# EAGLE design BlinkyCircuit (EAGLE 9.5.1)
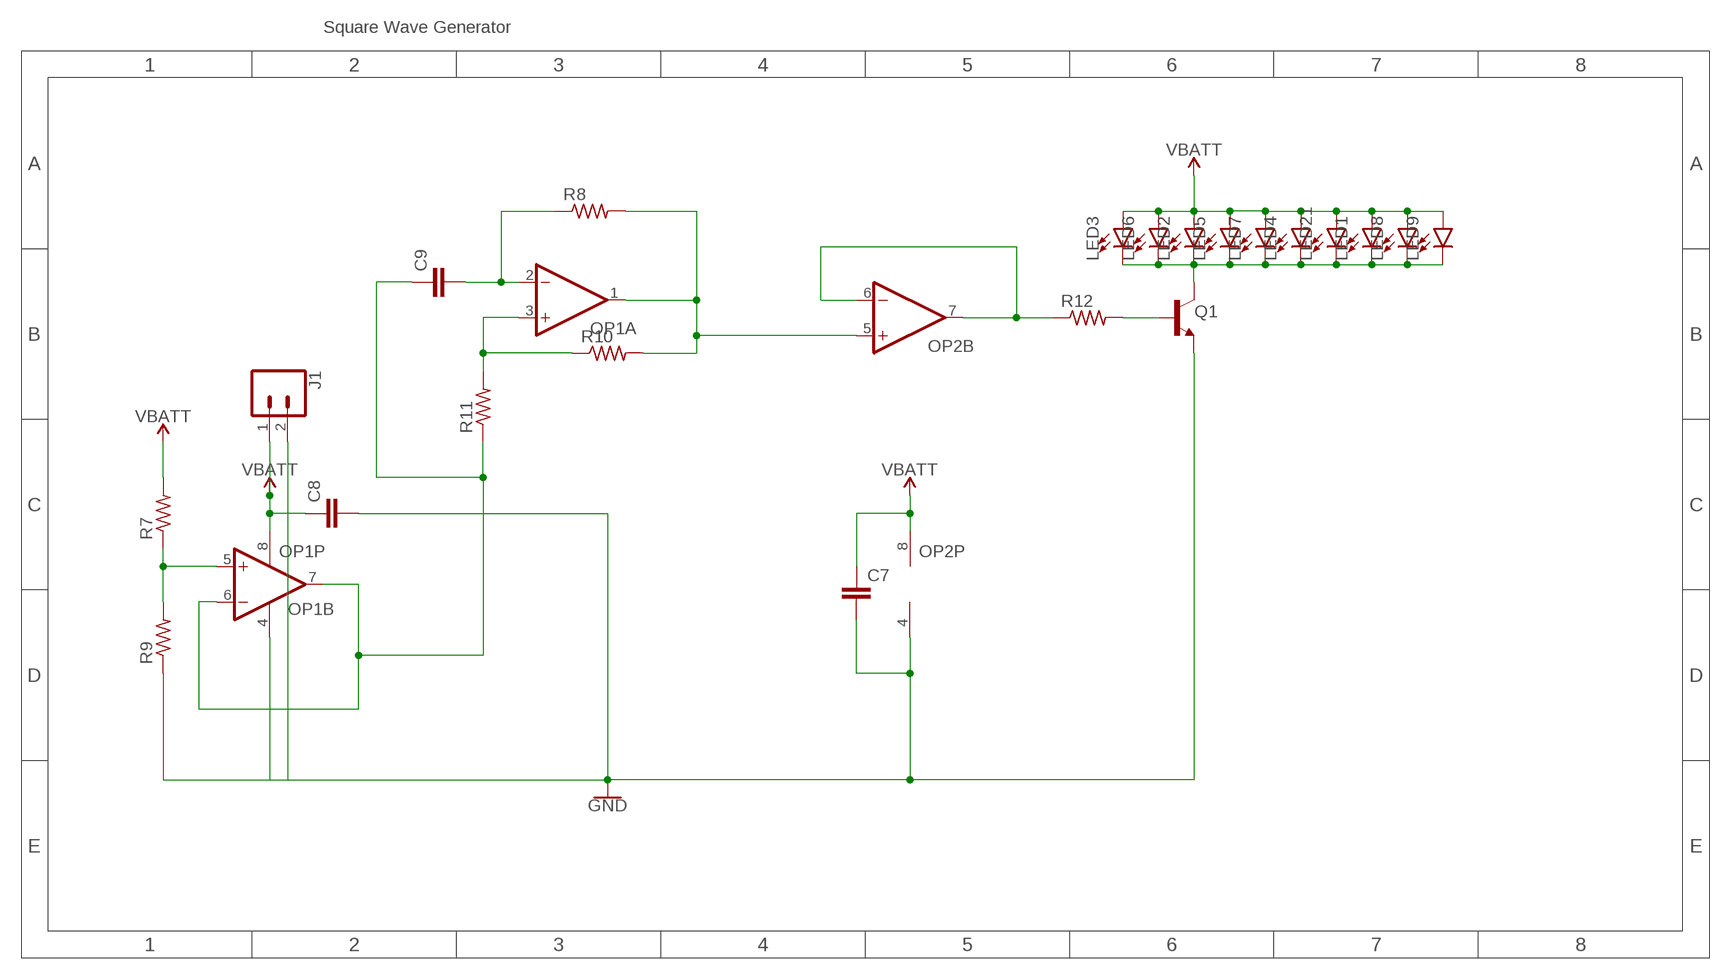
[diagram p0: schematic, sheet 1]

## Parts
C7  CAPACITOR0603  [C0603]
C8  CAPACITOR0603  [C0603]
C9  CAPACITOR0603  [C0603]
J1  CONN_02  [1X02]
LED1  LED5MM  [LED_5MM]
LED2  LED5MM  [LED_5MM]
LED3  LED5MM  [LED_5MM]
LED4  LED5MM  [LED_5MM]
LED5  LED5MM  [LED_5MM]
LED6  LED5MM  [LED_5MM]
LED7  LED5MM  [LED_5MM]
LED8  LED5MM  [LED_5MM]
LED9  LED5MM  [LED_5MM]
LED21  LED5MM  [LED_5MM]
OP1  OP-DUALR  [SO8]
OP2  OP-DUALR  [SO8]
Q1  NPN-GENERIC  [SOT23-3]
R7  RESISTOR0603  [R0603]
R8  RESISTOR0603  [R0603]
R9  RESISTOR0603  [R0603]
R10  RESISTOR0603  [R0603]
R11  RESISTOR0603  [R0603]
R12  RESISTOR0603  [R0603]

## Nets
GND: C7.2 C8.2 J1.2 OP1.4(P:V-) OP2.4(P:V-) Q1.2(E) R9.1
N$1: OP1.5(B:+IN) R7.1 R9.2
N$2: C9.2 OP1.2(A:-IN) R8.1
N$3: C9.1 OP1.6(B:-IN) OP1.7(B:OUT) R11.1
N$4: OP1.3(A:+IN) R10.1 R11.2
N$5: OP1.1(A:OUT) OP2.5(B:+IN) R8.2 R10.2
N$6: OP2.6(B:-IN) OP2.7(B:OUT) R12.1
N$7: Q1.1(B) R12.2
N$11: LED1.K(C) LED2.K(C) LED3.K(C) LED4.K(C) LED5.K(C) LED6.K(C) LED7.K(C) LED8.K(C) LED9.K(C) LED21.K(C) Q1.3(C)
V_BATT: C7.1 C8.1 J1.1 LED1.A LED2.A LED3.A LED4.A LED5.A LED6.A LED7.A LED8.A LED9.A LED21.A OP1.8(P:V+) OP2.8(P:V+) R7.2 ; supply symbol labelled VBATT
Unconnected: OP2.1(A:OUT) OP2.2(A:-IN) OP2.3(A:+IN)

## Notes on the sheet
- Square Wave Generator

## Library data of the parts
C7-C9 = LinnesLab-Passives:CAPACITOR
J1 = LinnesLab-Connectors:CONN_02: Multi connection point. Often used as Generic Header-pin footprint for 0.1 inch spaced/style header connections On any of the 0.1 inch spaced packages, you can populate with these: Break Away Headers - Straight <https://www.sparkfun.com/products/116> (PRT-00116) Break Away Male Headers - Right Angle <https://www.sparkfun.com/products/553> (PRT-00553) Female Headers <https://www.sparkfun.com/products/115> (PRT-00115) Break Away Headers - Machine Pin <https://www.sparkfun.com/products/117> (PRT-00117) Break Away Female Headers - Swiss Machine Pin <https://www.sparkfun.com/products/743> (PRT-00743) For SCREWTERMINALS and SPRING TERMINALS visit here: Screw Terimnals on SparkFun.com <https://www.sparkfun.com/search/results?term=Screw+Terminals> (5mm/3.5mm/2.54mm spacing) This device is also useful as a general connection point to wire up your design to another part of your project. Our various solder wires solder well into these plated through hole pads. Hook-Up Wire - Assortment (Stranded, 22 AWG) <https://www.sparkfun.com/products/11375> (PRT-11375) Hook-Up Wire - Assortment (Solid Core, 22 AWG) <https://www.sparkfun.com/products/11367> (PRT-11367) View the entire wire category on our website here <https://www.sparkfun.com/categories/141> Special notes: Molex polarized connector foot print use with: PRT-08233 with associated crimp pins and housings. 2.54_SCREWTERM for use with PRT-10571. 3.5mm Screw Terminal footprints for PRT-08084 5mm Screw Terminal footprints for use with PRT-08432
LED1-LED9 LED21 = LinnesLab-LED:LED: LED (Generic) Standard schematic elements and footprints for 5mm, 3mm, 1206, and 0603 sized LEDs. Generic LEDs with no color specified. LTST-C190KGKT: arrow indicates cathode
OP1 OP2 = LinnesLab-AnalogIC:OP-DUAL: Precision Micropower, Low Noise CMOS, Rail-to-Rail Input/Output Operational Amplifiers Source: http://www.analog.com/static/imported-files/data_sheets/AD8603_8607_8609.pdf; MPN: AD8607ARMZ-R2; OC_FARNELL: 1651293; OC_NEWARK: 19M8927
Q1 = LinnesLab-DiscreteSemi:NPN
R7-R12 = LinnesLab-Passives:RESISTOR

## Board
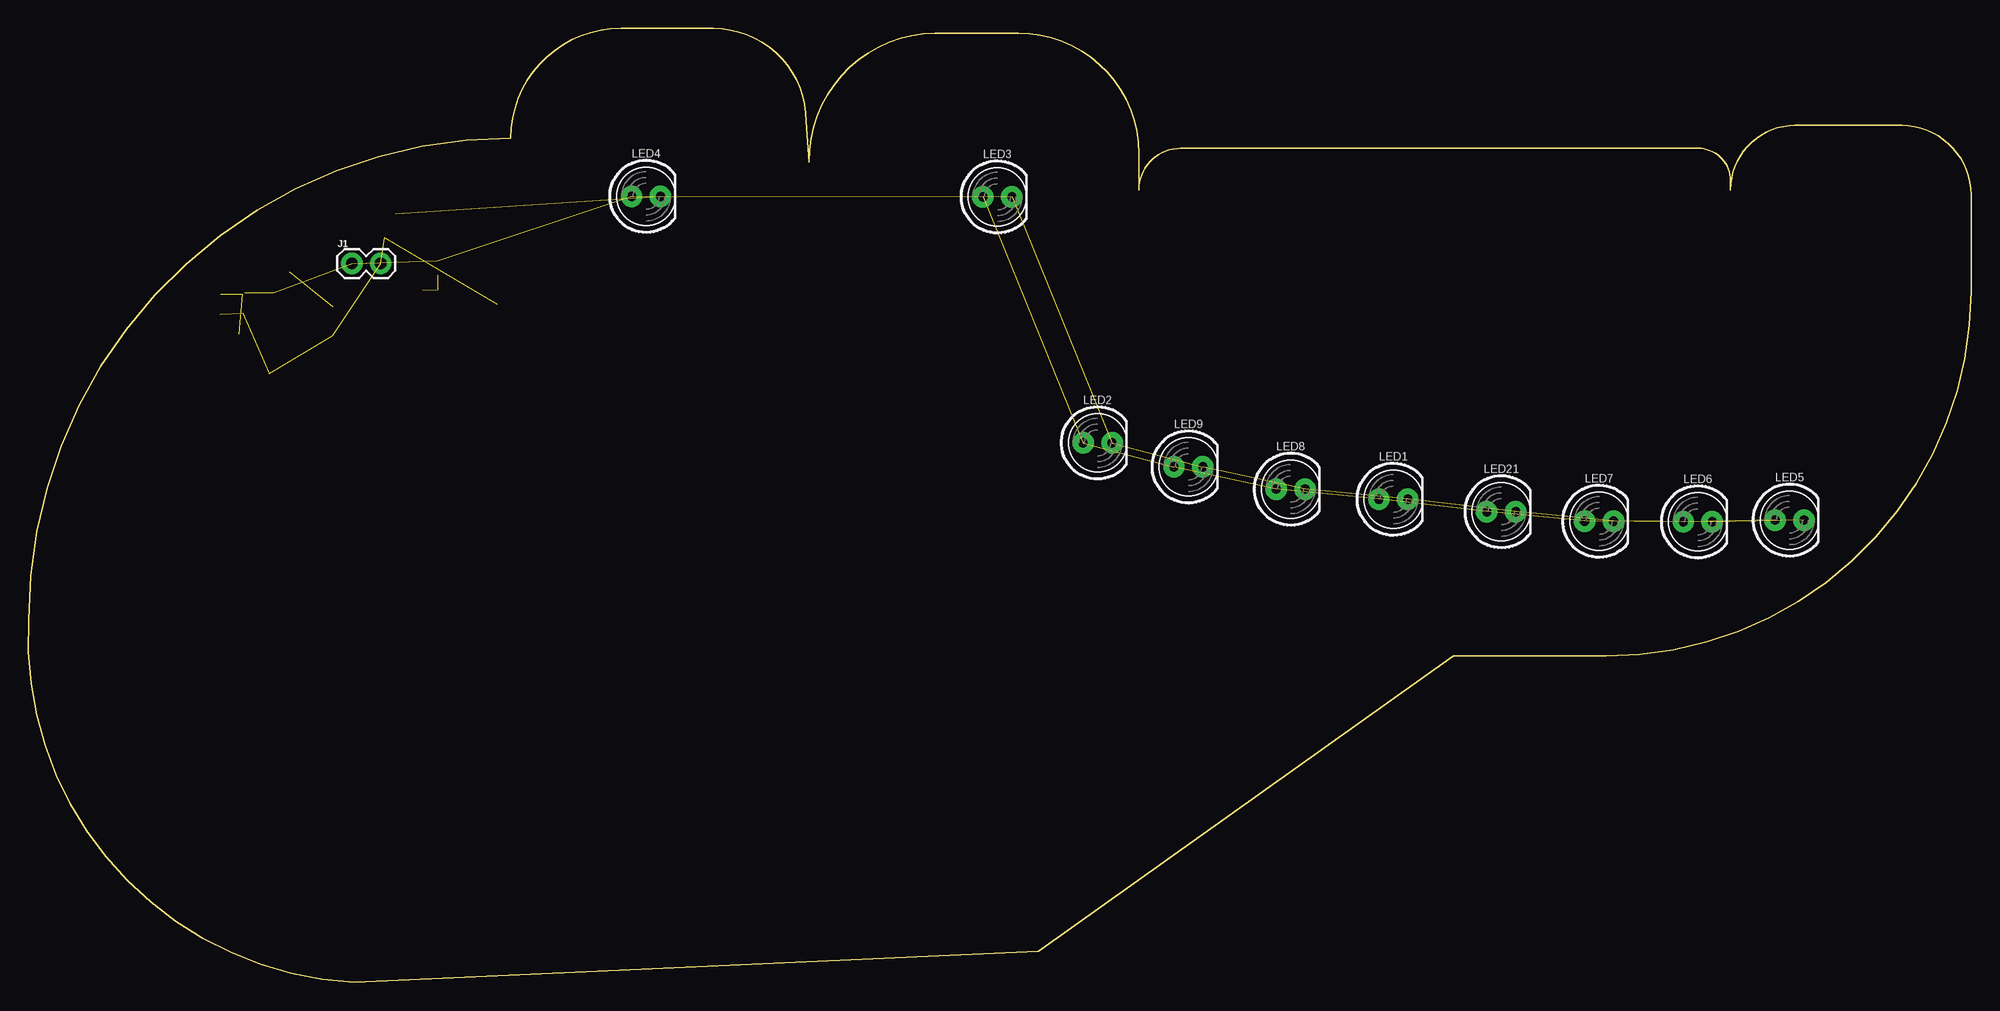
[diagram p1: board, top side]
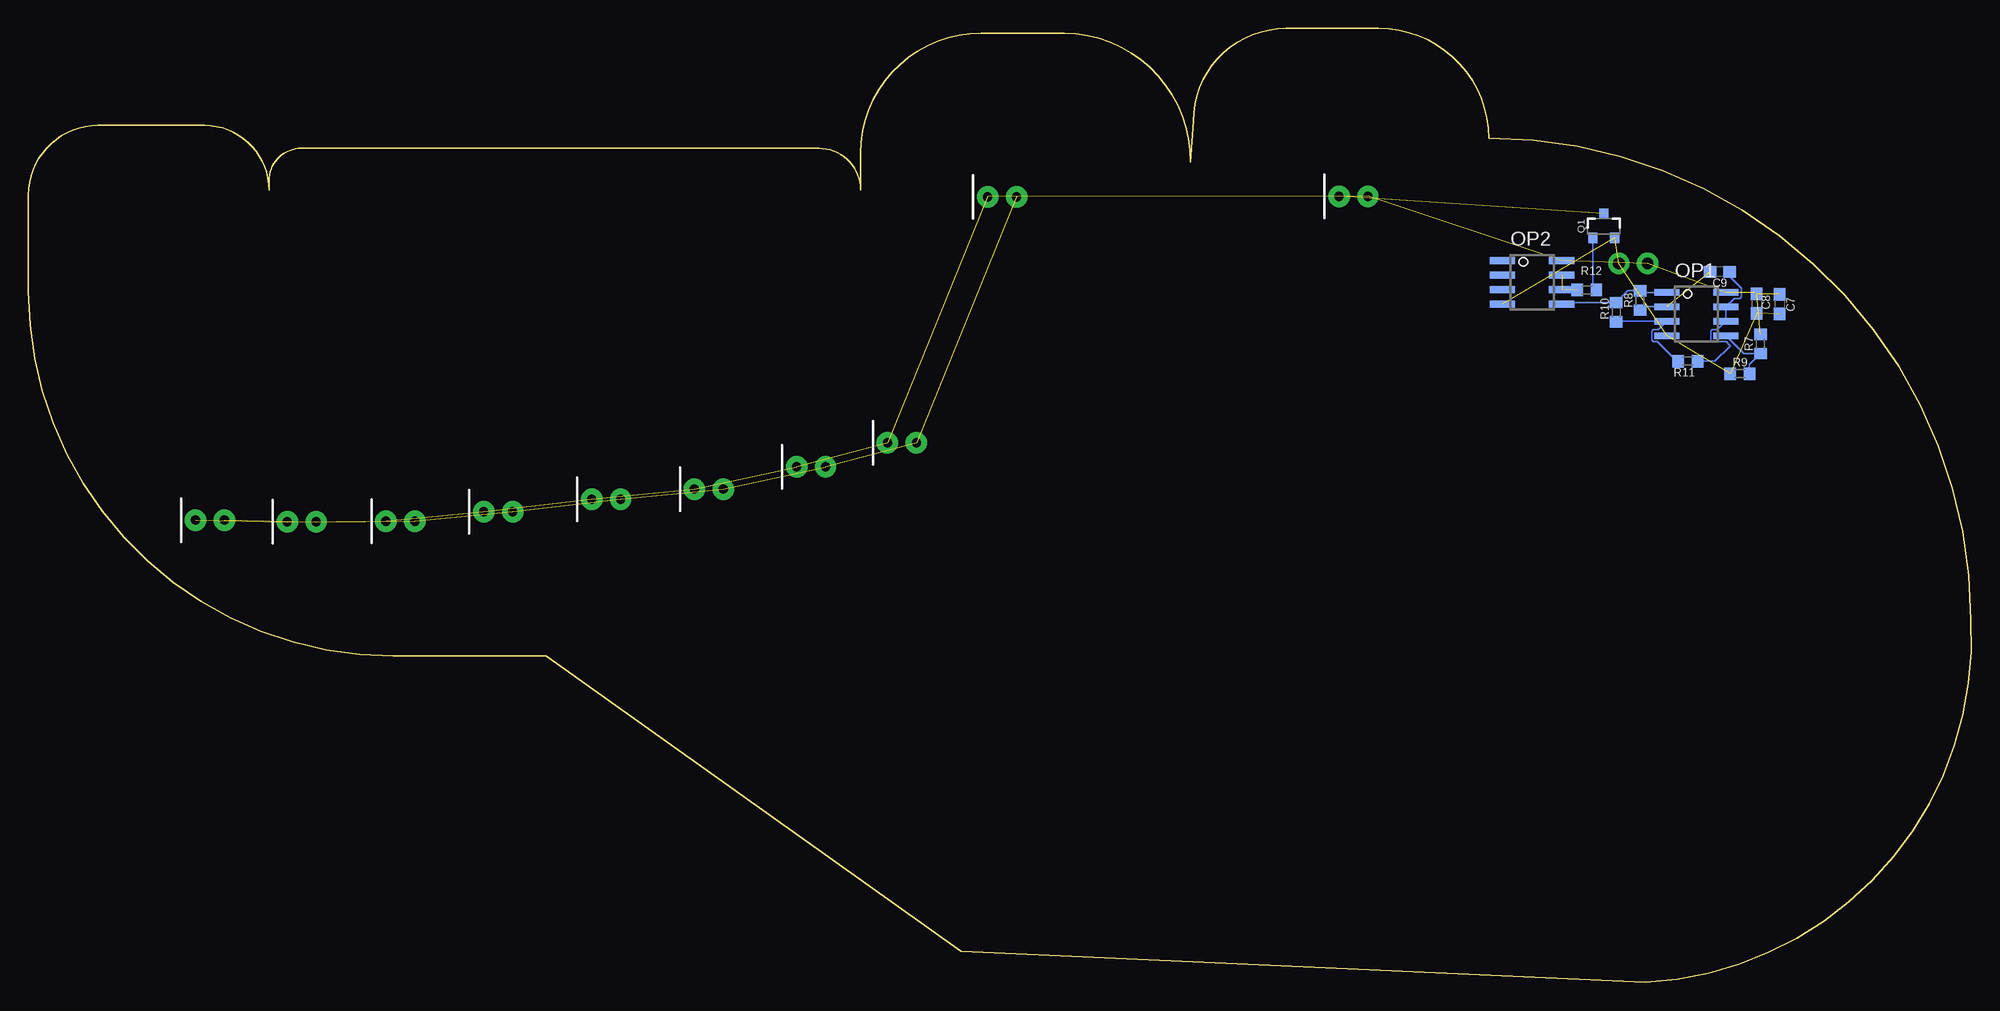
[diagram p2: board, bottom side, seen from below]

Size 170.48 x 83.74 mm. Coordinates in mm from the lower left corner, seen from the top.
Outline: 0.02,31.83 arc-90 42.31,74.12 arc-90 51.99,83.74 60.12,83.74 arc-90 68.25,75.62 68.5,72.01 arc-90 79.58,83.34 86.89,83.34 arc-90 97.46,72.77 97.46,69.57 arc-90 101.11,73.23 146.53,73.23 arc-90 149.37,70.38 149.37,69.57 arc-90 155.04,75.24 164.39,75.24 arc-90 170.48,69.14 170.48,60.66 arc-90 138.48,28.65 125.04,28.65 88.64,2.74 28.57,0 arc-90 0.02,31.83
Outline: 0.02,31.83 0.02,30.73
Copper layers (1*16): Top 0.035mm / dielectric 1.5mm / Bottom 0.035mm
Design rules "default": minimum track width 6mil, minimum drill 0.35mm, track to track 6mil, track to pad 6mil, pad to pad 6mil, via to via 6mil, smd to smd 6mil, copper to edge 40mil, drill to drill 6mil, minimum pad ring 10mil, minimum via ring 8mil, stop-mask expansion 4mil, vias tented up to drill 0mil, thermal gap 10mil

### Footprints (pad centres in the part's own frame; a part is rotated, then mirrored left to right if it is on the bottom)
C0603 = smd 1.1 x 1: 1 -0.85,0; 2 0.85,0
1X02 = drill 1.016 pad 1.88: 1 0,0; 2 2.54,0
LED_5MM = drill 0.813 pad 1.88: A -1.27,0; K 1.27,0
SO8 = smd 0.6 x 2.2: 1 -1.905,-2.6; 2 -0.635,-2.6; 3 0.635,-2.6; 4 1.905,-2.6; 5 1.905,2.6; 6 0.635,2.6; 7 -0.635,2.6; 8 -1.905,2.6
SOT23-3 = smd 0.8 x 0.9: 1 -0.95,-1; 2 0.95,-1; 3 0,1.1
R0603 = smd 1 x 1.1: 1 -0.85,0; 2 0.85,0

### Placement (x,y rotation side)
C7  16.81,59.54 270 bottom
C8  18.82,59.59 270 bottom
C9  22.04,62.38 180 bottom
J1  28.37,63.12 0 top
LED1  119.78,42.42 0 top
LED2  93.82,47.37 0 top
LED3  85.04,68.96 0 top
LED4  54.2,69.01 0 top
LED5  154.56,40.59 0 top
LED6  146.5,40.44 0 top
LED7  137.84,40.49 0 top
LED8  110.77,43.31 0 top
LED9  101.8,45.26 0 top
LED21  129.26,41.33 0 top
OP1  24.1,58.67 270 bottom
OP2  38.53,61.47 270 bottom
Q1  32.23,66.37 0 bottom
R7  18.49,56.06 90 bottom
R8  29.05,59.87 90 bottom
R9  20.29,53.44 0 bottom
R10  31.14,58.83 90 bottom
R11  24.86,54.53 180 bottom
R12  33.73,60.78 0 bottom

### Tracks (layer width: path | path; a pad name or v marks a point on that pad's centre or on a via)
GND  (6 unrouted)
N$1
  Bottom 0.152: OP1.5 19.94,55.21 R7.1 19.44,54.25 R9.2
N$2  (1 unrouted)
  Bottom 0.152: OP1.2 28.76,59.31 R8.1
N$3
  Bottom 0.152: C9.1 21.19,62 20.17,60.97 20.17,60.18 20.31,60.05 20.76,60.05 OP1.7 OP1.6 22.24,57.3 22.7,57.3 22.83,57.16 22.83,56.37 22.7,56.24 21.49,56.24 21.13,55.88 22.48,54.53 R11.1
N$4
  Bottom 0.152: R10.1 31.07,58.04 OP1.3 27.44,57.3 27.9,57.3 28.03,57.16 28.03,56.37 27.9,56.24 27.51,56.24 25.8,54.53 | 26.16,54.53 25.8,54.53 | 25.8,54.53 R11.2
N$5
  Bottom 0.152: OP1.1 28.92,60.58 R8.2 30.1,60.72 R10.2 35.82,59.68 OP2.5
N$6  (2 unrouted)
N$7
  Bottom 0.152: Q1.1 33.18,61.08 R12.2
N$11  (10 unrouted)
V_BATT  (15 unrouted)
  Bottom 0.152: C8.1 18.96,60.58 | C7.1 16.86,60.44